# Altium schematic sheet PCB_AD_Top.SchDoc
size A4; DocumentNumber: 1; SheetNumber: 1; SheetTotal: 5
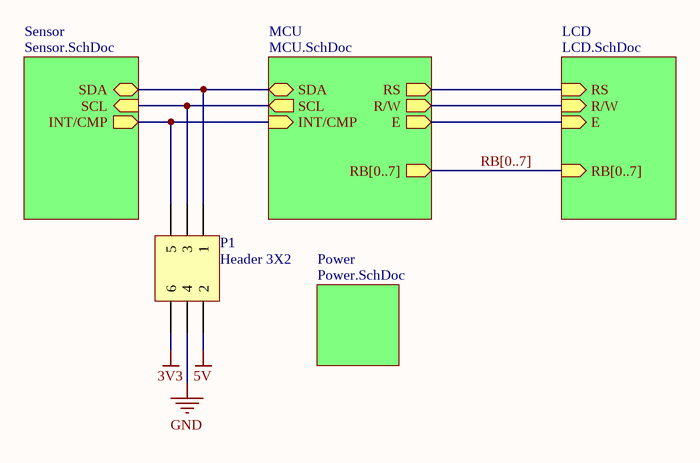
[diagram p0: PCB_AD_Top.SchDoc]

## Parts
P1  Header 3X2  [PH2X3]

## Sub-sheets
LCD = LCD.SchDoc: RS (in), R/W (in), E (in), RB[0..7] (in)
MCU = MCU.SchDoc: SDA (bidir), SCL (out), INT/CMP (in), RS (out), R/W (out), E (out), RB[0..7] (out)
Power = Power.SchDoc: no entries
Sensor = Sensor.SchDoc: SDA (bidir), SCL (in), INT/CMP (out)

## Nets
3V3: P1.6
5V: P1.2
GND: P1.4
NetP1_1: P1.1 ; sheet Sensor/SDA, sheet MCU/SDA
NetP1_3: P1.3 ; sheet Sensor/SCL, sheet MCU/SCL
NetP1_5: P1.5 ; sheet Sensor/INT/CMP, sheet MCU/INT/CMP
(unnamed): sheet MCU/RS, sheet LCD/RS
(unnamed): sheet MCU/R/W, sheet LCD/R/W
(unnamed): sheet MCU/E, sheet LCD/E

## Buses and harness runs
bus RB[0..7] = sheet LCD/RB[0..7] = sheet MCU/RB[0..7]

## Library data of the parts
P1 = Header 3X2: Header, 3-Pin, Dual row; LatestRevisionDate: 17-Jul-2002; LatestRevisionNote: Re-released for DXP Platform.; Publisher: Altium Limited